# Altium schematic sheet QCLogic Rev A Sht5 MEMS.SchDoc
size A4
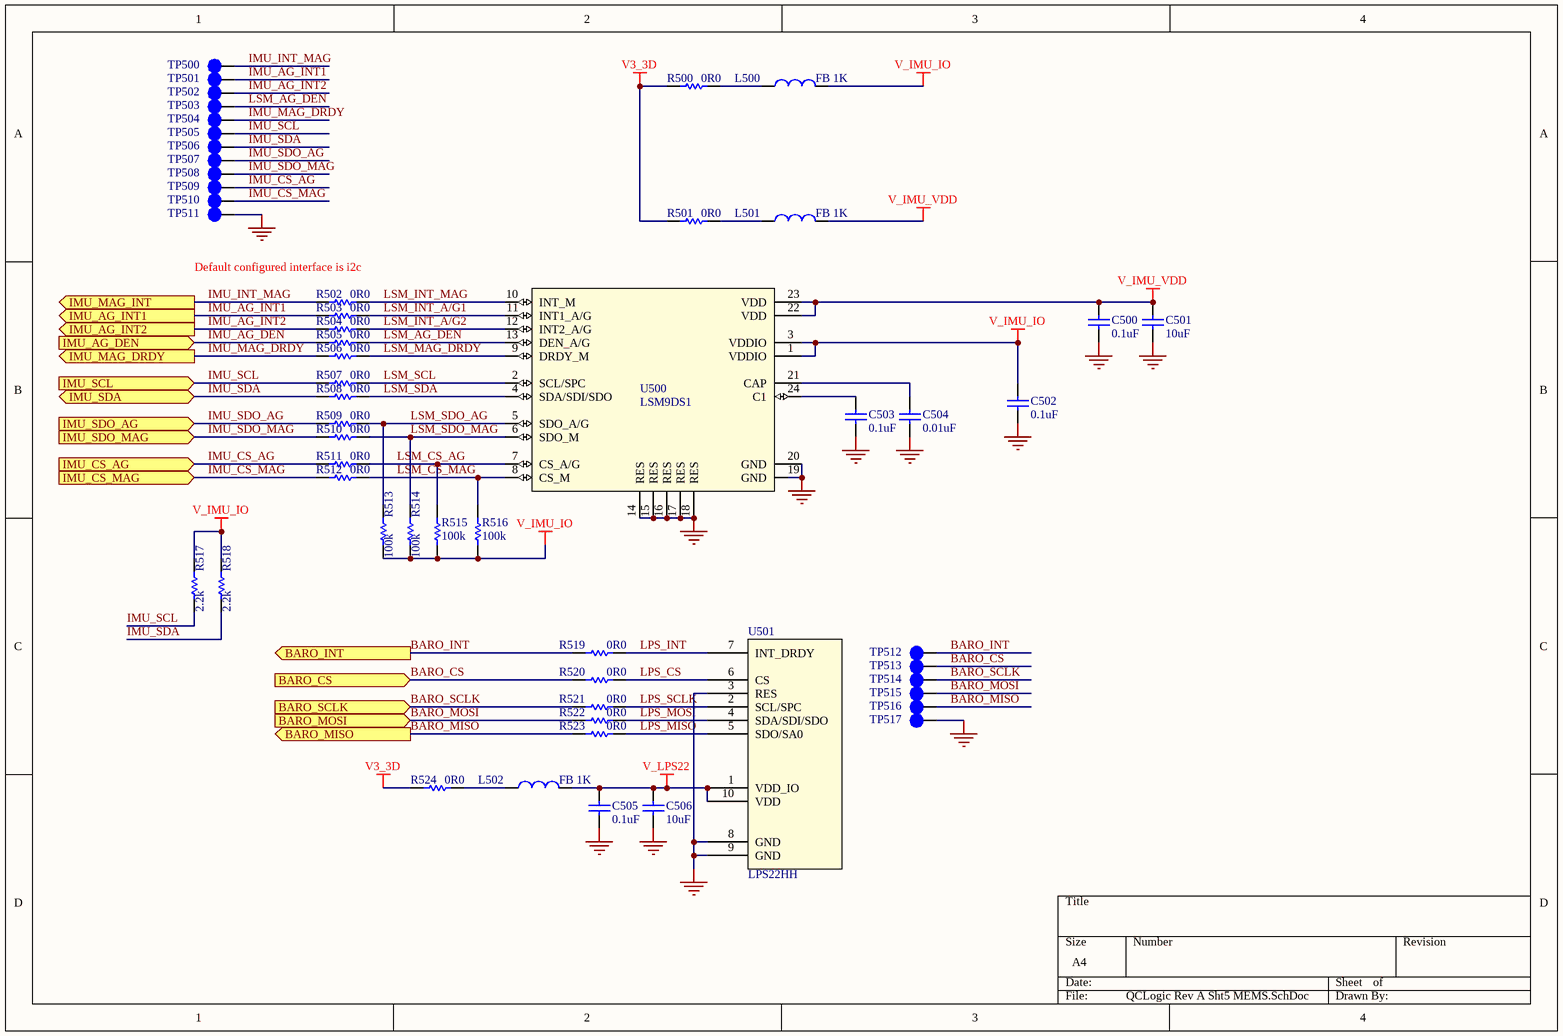
[diagram p0: QCLogic Rev A Sht5 MEMS.SchDoc]

## Parts
C500  0.1uF  [SMD CAP 0402]
C501  10uF  [SMD CAP 0805]
C502  0.1uF  [SMD CAP 0402]
C503  0.1uF  [SMD CAP 0402]
C504  0.01uF  [SMD CAP 0402]
C505  0.1uF  [SMD CAP 0402]
C506  10uF  [SMD CAP 0805]
L500  FB 1K  [SMD RES 0402]
L501  FB 1K  [SMD RES 0402]
L502  FB 1K  [SMD RES 0402]
R500  0R0  [SMD RES 0402]
R501  0R0  [SMD RES 0402]
R502  0R0  [SMD RES 0402]
R503  0R0  [SMD RES 0402]
R504  0R0  [SMD RES 0402]
R505  0R0  [SMD RES 0402]
R506  0R0  [SMD RES 0402]
R507  0R0  [SMD RES 0402]
R508  0R0  [SMD RES 0402]
R509  0R0  [SMD RES 0402]
R510  0R0  [SMD RES 0402]
R511  0R0  [SMD RES 0402]
R512  0R0  [SMD RES 0402]
R513  100k  [SMD RES 0402]
R514  100k  [SMD RES 0402]
R515  100k  [SMD RES 0402]
R516  100k  [SMD RES 0402]
R517  2.2k  [SMD RES 0402]
R518  2.2k  [SMD RES 0402]
R519  0R0  [SMD RES 0402]
R520  0R0  [SMD RES 0402]
R521  0R0  [SMD RES 0402]
R522  0R0  [SMD RES 0402]
R523  0R0  [SMD RES 0402]
R524  0R0  [SMD RES 0402]
TP500  TESTPOINT SMD  [TESTPOINT 0.5mm DIA]  (value not drawn)  (no BOM)
TP501  TESTPOINT SMD  [TESTPOINT 0.5mm DIA]  (value not drawn)  (no BOM)
TP502  TESTPOINT SMD  [TESTPOINT 0.5mm DIA]  (value not drawn)  (no BOM)
TP503  TESTPOINT SMD  [TESTPOINT 0.5mm DIA]  (value not drawn)  (no BOM)
TP504  TESTPOINT SMD  [TESTPOINT 0.5mm DIA]  (value not drawn)  (no BOM)
TP505  TESTPOINT SMD  [TESTPOINT 0.5mm DIA]  (value not drawn)  (no BOM)
TP506  TESTPOINT SMD  [TESTPOINT 0.5mm DIA]  (value not drawn)  (no BOM)
TP507  TESTPOINT SMD  [TESTPOINT 0.5mm DIA]  (value not drawn)  (no BOM)
TP508  TESTPOINT SMD  [TESTPOINT 0.5mm DIA]  (value not drawn)  (no BOM)
TP509  TESTPOINT SMD  [TESTPOINT 0.5mm DIA]  (value not drawn)  (no BOM)
TP510  TESTPOINT SMD  [TESTPOINT 0.5mm DIA]  (value not drawn)  (no BOM)
TP511  TESTPOINT SMD  [TESTPOINT 1mm DIA]  (value not drawn)  (no BOM)
TP512  TESTPOINT SMD  [TESTPOINT 0.5mm DIA]  (value not drawn)  (no BOM)
TP513  TESTPOINT SMD  [TESTPOINT 0.5mm DIA]  (value not drawn)  (no BOM)
TP514  TESTPOINT SMD  [TESTPOINT 0.5mm DIA]  (value not drawn)  (no BOM)
TP515  TESTPOINT SMD  [TESTPOINT 0.5mm DIA]  (value not drawn)  (no BOM)
TP516  TESTPOINT SMD  [TESTPOINT 0.5mm DIA]  (value not drawn)  (no BOM)
TP517  TESTPOINT SMD  [TESTPOINT 0.5mm DIA]  (value not drawn)  (no BOM)
U500  LSM9DS1  [LGA-24]
U501  LPS22HH  [LGA-10]

## Ports
BARO_CS (in), BARO_INT (out), BARO_MISO (out), BARO_MOSI (in), BARO_SCLK (in), IMU_AG_DEN (in), IMU_AG_INT1 (out), IMU_AG_INT2 (out), IMU_CS_AG (in), IMU_CS_MAG (in), IMU_MAG_DRDY (out), IMU_MAG_INT (out), IMU_SCL (in), IMU_SDA (bidir), IMU_SDO_AG (in), IMU_SDO_MAG (in)

## Nets
GND: C500.1 C501.2 C502.1 C503.1 C504.2 C505.1 C506.2 TP511.1 TP517.1 U500.14(RES) U500.15(RES) U500.16(RES) U500.17(RES) U500.18(RES) U500.19(GND) U500.20(GND) U501.3(RES) U501.8(GND) U501.9(GND)
V3_3D: R500.1 R501.1 R524.1
V_IMU_IO: C502.2 L500.2 R513.2 R514.2 R515.2 R516.2 R517.1 R518.1 U500.1(VDDIO) U500.3(VDDIO)
V_IMU_VDD: C500.2 C501.1 L501.2 U500.22(VDD) U500.23(VDD)
V_LPS22: C505.2 C506.1 L502.2 U501.1(VDD_IO) U501.10(VDD)
BARO_CS: R520.1 TP513.1 ; port BARO_CS
BARO_INT: R519.1 TP512.1 ; port BARO_INT
BARO_MISO: R523.1 TP516.1 ; port BARO_MISO
BARO_MOSI: R522.1 TP515.1 ; port BARO_MOSI
BARO_SCLK: R521.1 TP514.1 ; port BARO_SCLK
IMU_AG_DEN: R505.1 ; port IMU_AG_DEN
IMU_AG_INT1: R503.1 TP501.1 ; port IMU_AG_INT1
IMU_AG_INT2: R504.1 TP502.1 ; port IMU_AG_INT2
IMU_CS_AG: R511.1 TP509.1 ; port IMU_CS_AG
IMU_CS_MAG: R512.1 TP510.1 ; port IMU_CS_MAG
IMU_INT_MAG: R502.1 TP500.1 ; port IMU_MAG_INT
IMU_MAG_DRDY: R506.1 TP504.1 ; port IMU_MAG_DRDY
IMU_SCL: R507.1 R517.2 TP505.1 ; port IMU_SCL
IMU_SDA: R508.1 R518.2 TP506.1 ; port IMU_SDA
IMU_SDO_AG: R509.1 TP507.1 ; port IMU_SDO_AG
IMU_SDO_MAG: R510.1 TP508.1 ; port IMU_SDO_MAG
LPS_CS: R520.2 U501.6(CS)
LPS_INT: R519.2 U501.7(INT_DRDY)
LPS_MISO: R523.2 U501.5(SDO/SA0)
LPS_MOSI: R522.2 U501.4(SDA/SDI/SDO)
LPS_SCLK: R521.2 U501.2(SCL/SPC)
LSM_AG_DEN: R505.2 TP503.1 U500.13(DEN_A/G)
LSM_CS_AG: R511.2 R515.1 U500.7(CS_A/G)
LSM_CS_MAG: R512.2 R516.1 U500.8(CS_M)
LSM_INT_A/G1: R503.2 U500.11(INT1_A/G)
LSM_INT_A/G2: R504.2 U500.12(INT2_A/G)
LSM_INT_MAG: R502.2 U500.10(INT_M)
LSM_MAG_DRDY: R506.2 U500.9(DRDY_M)
LSM_SCL: R507.2 U500.2(SCL/SPC)
LSM_SDA: R508.2 U500.4(SDA/SDI/SDO)
LSM_SDO_AG: R509.2 R513.1 U500.5(SDO_A/G)
LSM_SDO_MAG: R510.2 R514.1 U500.6(SDO_M)
NetC503_2: C503.2 U500.24(C1)
NetC504_1: C504.1 U500.21(CAP)
NetL500_1: L500.1 R500.2
NetL501_1: L501.1 R501.2
NetL502_1: L502.1 R524.2

## Notes on the sheet
- Default configured interface is i2c

## Library data of the parts
C500 C502 C503 C505 = CAP MLCC SMD: CAP CER 0.1UF 25V X7R 0402; 1. Manufacturer: Yageo; 2. Manufacturer Part Number: CC0402KRX7R8BB104; 4. Package: 0402; 3. Date Modified: 20201122
C501 C506 = CAP MLCC SMD: CAP CER 10UF 25V X5R 0805; 1. Manufacturer: Taiyo Yuden; 2. Manufacturer Part Number: TMK212BBJ106KG-T; 4. Package: 0805; 3. Date Modified: 20201128
C504 = CAP MLCC SMD: CAP CER 10000PF 16V X7R 0402; 1. Manufacturer: Walsin Technology Corporation; 2. Manufacturer Part Number: 0402B103K160CT; 4. Package: 0402; 3. Date Modified: 20201122
L500-L502 = INDUCTOR: FERRITE BEAD 1 KOHM 0402 1LN; 1. Manufacturer: Murata Electronics; 2. Manufacturer Part Number: BLM15HD102SN1D; 3. Date Modified: 20201122
R500-R512 R519-R524 = RES SMD: RES SMD 0 OHM JUMPER 1/16W 0402; 1. Manufacturer: Yageo; 2. Manufacturer Part Number: RC0402FR-070RL; 4. Package: 0402; 3. Date Modified: 20201122
R513-R516 = RES SMD: RES SMD 100K OHM 1% 1/16W 0402; 1. Manufacturer: Yageo; 2. Manufacturer Part Number: RC0402FR-07100KL; 4. Package: 0402; 3. Date Modified: 20201126
R517 R518 = RES SMD: RES SMD 2.2K OHM 1% 1/16W 0402; 1. Manufacturer: Yageo; 2. Manufacturer Part Number: RC0402FR-072K2L; 4. Package: 0402; 3. Date Modified: 20201126
TP500-TP517 = TESTPOINT PAD: TESTPOINT SMD PAD; 1. Manufacturer: *; 2. Manufacturer Part Number: *; 3. Date Modified: *
U500 = IC IMU ACCEL/GYRO/MAG I2C/SPI 24LGA LSM9DS1: IMU ACCEL/GYRO/MAG I2C/SPI 24LGA LSM9DS1; 1. Manufacturer: STMicroelectronics; 2. Manufacturer Part Number: LSM9DS1TR; 3. Date Modified: 20201122
U501 = IC BARO PRESSURE SENSOR LPS22HH: 1. Manufacturer: STMicroelectronics; 2. Manufacturer Part Number: LPS22HHTR; 3. Date Modified: 20201122